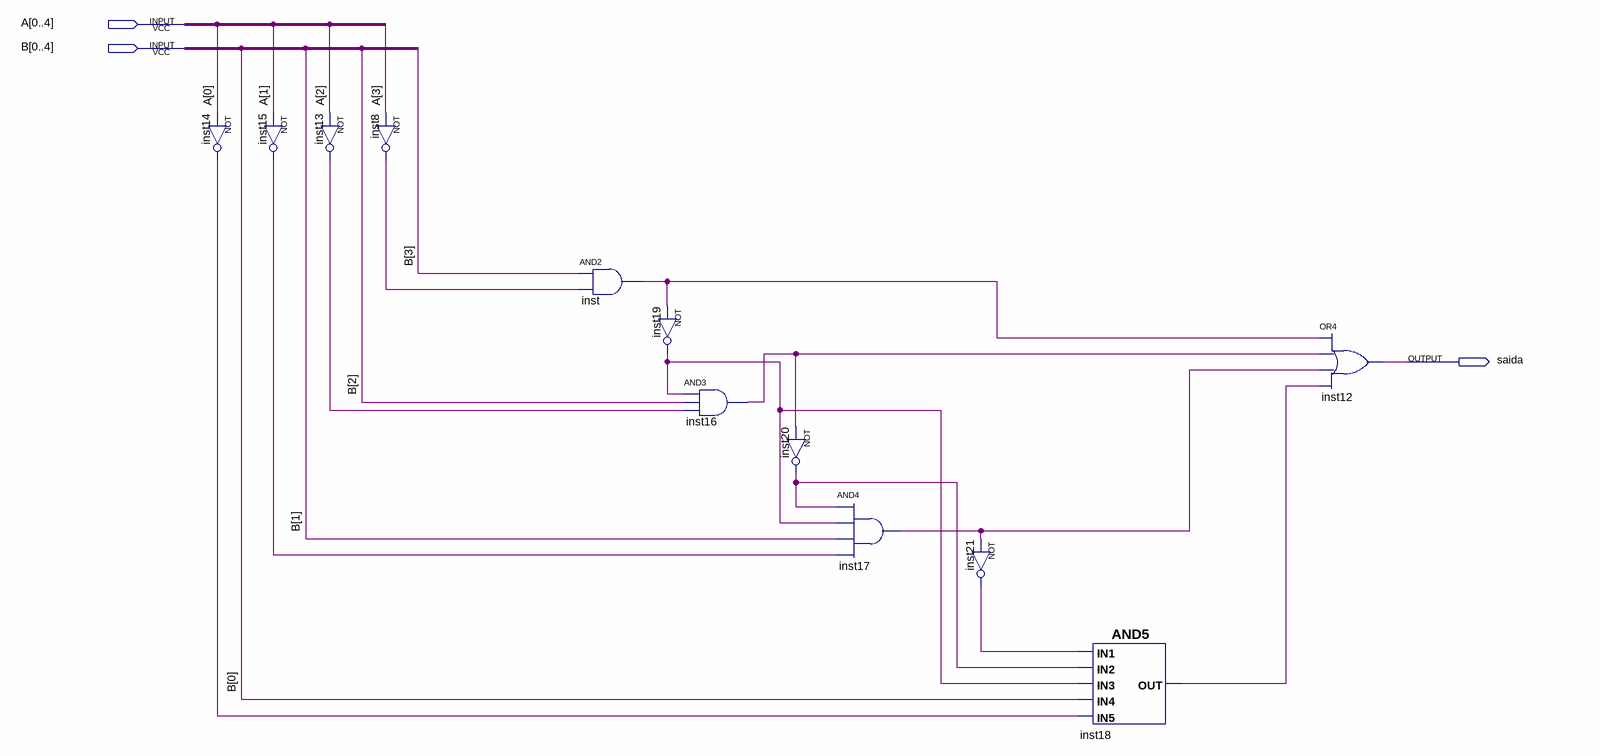
[diagram p0: schematic sheet]
// Quartus schematic AmenorqB.bdf as structural Verilog: 12 symbols, 3 pins
module AmenorqB (
  input  [0:4] A,
  input  [0:4] B,
  output saida
);

  wire inst8_out, inst13_out, inst14_out, inst15_out, inst16_out, inst17_out, inst18_out, inst19_out,
       inst20_out, inst21_out, inst_out;

  not inst14 (inst14_out, A[0]);
  not inst13 (inst13_out, A[2]);
  not inst15 (inst15_out, A[1]);
  not inst8 (inst8_out, A[3]);
  and inst (inst_out, B[3], inst8_out);
  not inst19 (inst19_out, inst_out);
  and inst16 (inst16_out, inst19_out, B[2], inst13_out);
  not inst20 (inst20_out, inst16_out);
  and inst17 (inst17_out, inst20_out, inst19_out, B[1], inst15_out);
  not inst21 (inst21_out, inst17_out);
  and inst18 (inst18_out, inst21_out, inst20_out, inst19_out, B[0], inst14_out);
  or inst12 (saida, inst_out, inst16_out, inst17_out, inst18_out);
endmodule
